# Altium schematic sheet crystals.SchDoc
size A3; DocumentNumber: 8; SheetNumber: 8; SheetTotal: 24; SheetDescription: Crystals for MCU0
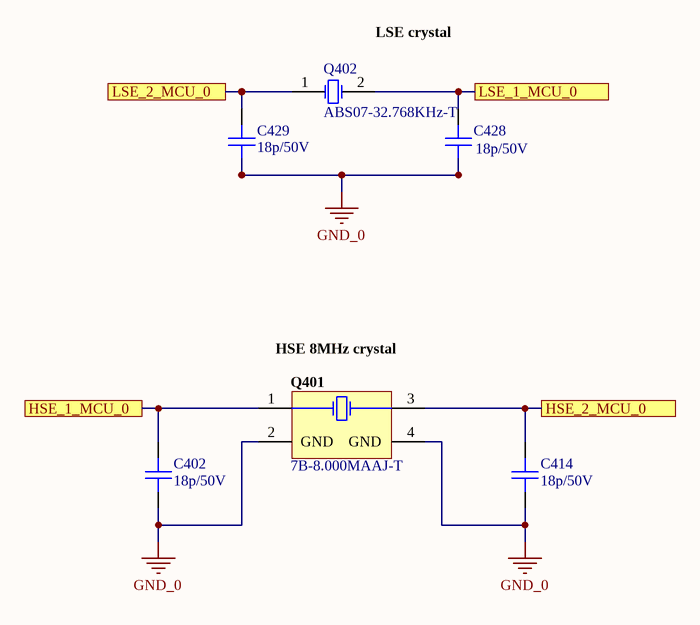
[diagram p0: crystals.SchDoc]

## Parts
C402  18p/50V  [CAPC1608X08N]
C414  18p/50V  [CAPC1608X08N]
C428  18p/50V  [CAPC1608X08N]
C429  18p/50V  [CAPC1608X08N]
Q401  7B-8.000MAAJ-T  [TXC-7B-4_V]
Q402  ABS07-32.768KHz-T  [ABRA-ABS07-2_V]

## Ports
HSE_1_MCU_0, HSE_2_MCU_0, LSE_1_MCU_0, LSE_2_MCU_0

## Nets
GND_0: C402.1 C414.2 C428.1 C429.2 Q401.2(GND) Q401.4(GND)
HSE_1_MCU_0: C402.2 Q401.1(X1) ; port HSE_1_MCU_0
HSE_2_MCU_0: C414.1 Q401.3(X2) ; port HSE_2_MCU_0
LSE_1_MCU_0: C428.2 Q402.2(X2) ; port LSE_1_MCU_0
LSE_2_MCU_0: C429.1 Q402.1(X1) ; port LSE_2_MCU_0

## Notes on the sheet
- (near Q402) LSE crystal
- (near Q401) HSE 8MHz crystal
- Fraunhofer IISB
- Schottkystr. 10
- developed by:
- 91058 Erlangen
- Germany
- Author
- Project
- License
- Description
- File
- Version
- Release Date
- Sheet
- www.foxbms.org
- www.iisb.fraunhofer.de
- foxBMS Team
- /

## Library data of the parts
C402 C414 C428 C429 = gen_C_ceramic_18p_50V_C0G_0603: MLCC; Capacitance: 18p; Rated Voltage: 50V; Dielectric: C0G; Case EIA: 0603; Case Metric: 1608; Automotive Qualified: False; Part Number: gen_C_ceramic_18p_50V_C0G_0603; Supplier 1: Farnell; Supplier Part Number 1: 2070403
Q401 = CMP-1774-00004-1: SMD Seam Sealing Crystal, 8 MHz, +/- 30 ppm, 18 pF, -10 to 70 degC, 4-Pin SMD, RoHS, Tape and Reel; Power Rating: 100 mW; Case\Package: 0603; Voltage Rating: 50 V; Tolerance: 1%; Resistance: 150 Ohm; Package Quantity: 5000; Case Code (Metric): 1608; Packaging: Tape and Reel; Length: 1.6 mm; RoHSCompliant: true; REACH SVHC: No SVHC; Mount: Surface Mount; Case Code (Imperial): 0603; Pins: 2; Width: 0.8 mm; PackageDescription: 4-Pin Surface Mount Device, Body 5 x 3.2 mm, Pitch 3.7 mm; ComponentLink1Description: Datasheet; DatasheetVersion: Jul-15; ComponentLink1URL: http://www.txccorp.com/download/products/quartz_crystals/2015TXC_7B_19.pdf; PackageReference: 7B-4; Height: 0.45 mm; Max Operating Temperature: 155 degC; Min Operating Temperature: -55 degC; Voltage Rating (DC): 50 V
Q402 = CMP-0447-00001-2: Crystal, 32.768 kHz, 12.5 pF, -40 to 85 degC, SMD Low Profile 3.2 x 1.5 x 0.9 mm, Tape and Reel; Manufacturer: Abracon; Q Value (Type): 30000; Operation Mode: Flexural Mode (Tuning Fork); Shunt Capacitance (C0): 0.9 to 1.2 pF; Load Capacitance (CL): 12.5 pF; Frequency Tolerance @+25degC: +/- 20 ppm; Drive Level (Type): 0.1 uW; Equivalent Series Resistance (R1): 70 Kohm; Insulation Resistance (Min): 500 Mohm; ComponentLink3URL: http://www.abracon.com/Resonators/ABS07.pdf; PackageDescription: 2-Pin Hand Drawn, Body 3.2x1.5mm, Pitch 2.5mm; Operating Temperature: -40 to 85 degC; ComponentLink2URL: http://www.abracon.com/Resonators/ABS07.pdf; PackageReference: ABS07-2; ComponentLink3Description: Package Specification; ComponentLink1Description: Manufacturer URL; DatasheetVersion: 04.03.13; Mounting Technology: Surface Mount; ComponentLink2Description: Datasheet; ComponentLink1URL: http://www.abracon.com/; PartNumber: ABS07-32.768KHz-T; Packing: Tape and Reel; Frequency: 32.768 kHz